# EAGLE board sd card copier (EAGLE 8.3.1)
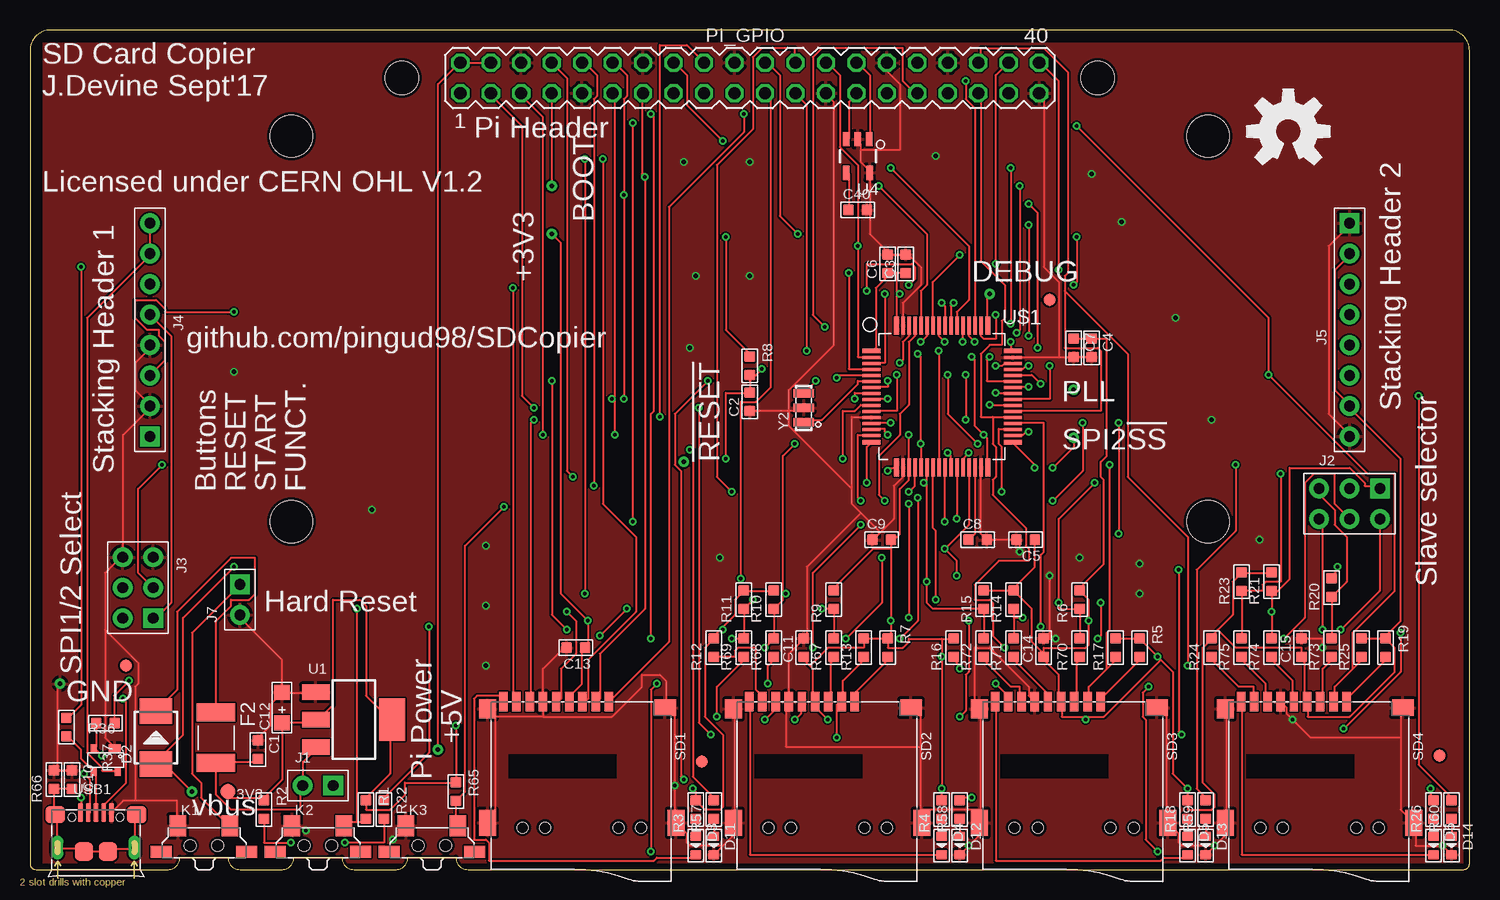
[diagram p2: board, top side]
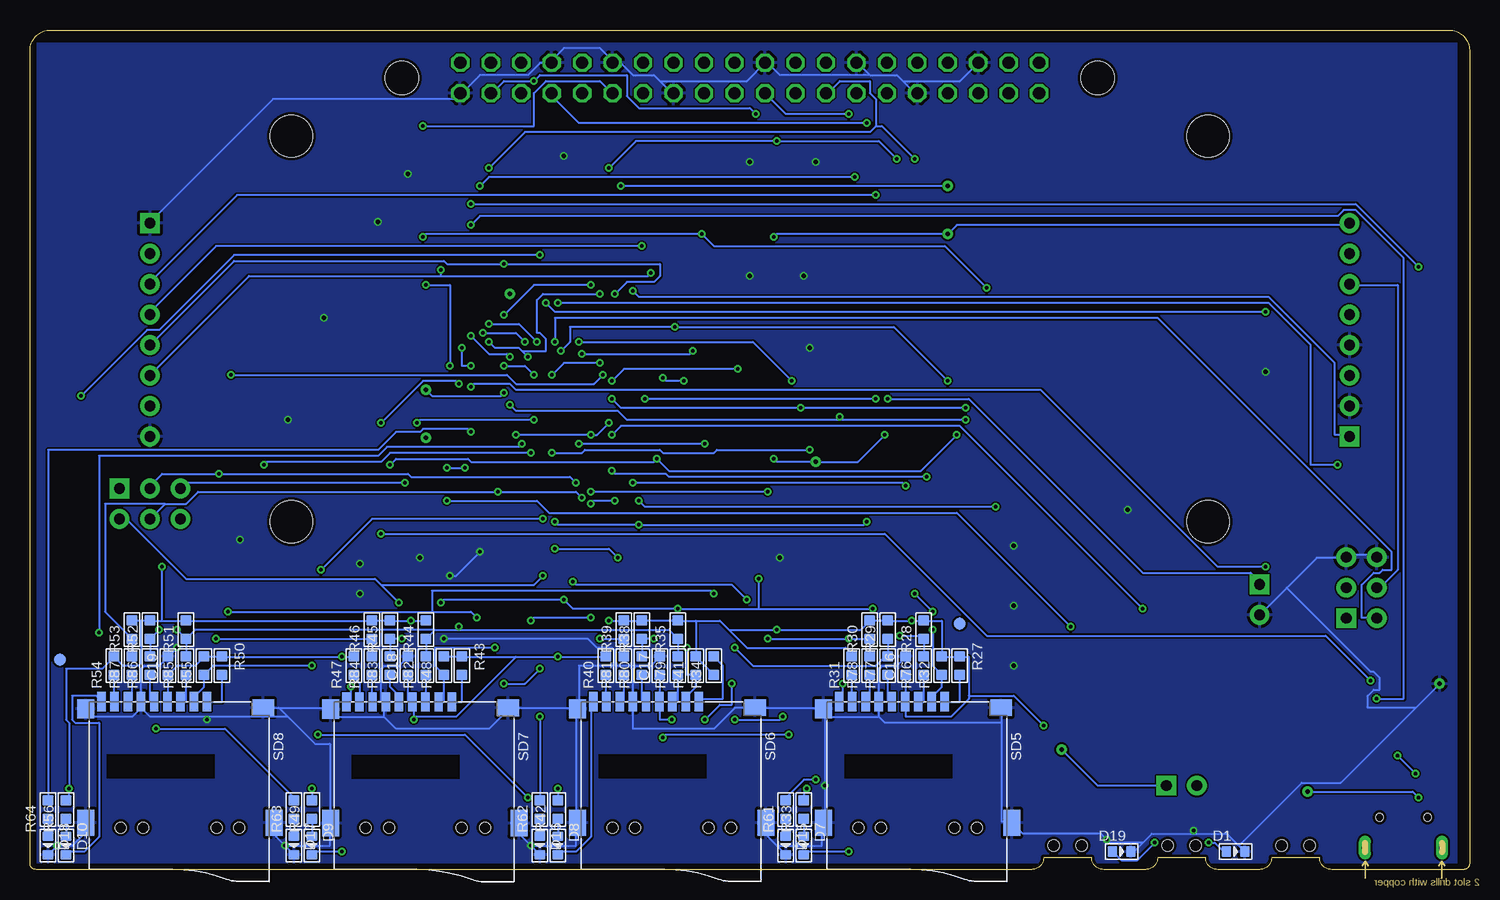
[diagram p3: board, bottom side, seen from below]

Size 120 x 70 mm. Coordinates in mm from the lower left corner, seen from the top.
Outline: 36.5,0 119.5,0 arc90 120,0.5 120,68.29 arc90 118.29,70 1.71,70 arc90 0,68.29 0,0.5 arc90 0.5,0 11.5,0 arc90 12.5,1 16.5,1 arc90 17.5,0 21,0 arc90 22,1 26,1 arc90 27,0 30.5,0 arc90 31.5,1 35.5,1 arc90 36.5,0
Copper layers (1*16): Top 0.035mm / dielectric 1.5mm / Bottom 0.035mm
Design rules "SeeedStudio_2layer_DRU_no_angle_20140221": minimum track width 6mil, minimum drill 12mil, track to track 6mil, track to pad 6mil, pad to pad 6mil, via to via 6mil, smd to smd 0mil, copper to edge 10mil, drill to drill 10mil, minimum pad ring 10mil, minimum via ring 6mil, stop-mask expansion 2mil, vias tented up to drill 100mil, thermal gap 10mil
Net classes: 2 thin_power: width 0.254 mm
Holes 3.51 mm at 21.8,29 98.2,29 21.8,61.15 98.2,61.15
Holes 2.75 mm at 31,66 89,66
tRestrict: area -1,-0.5 to 1,71; area 0,69 to 120,71; area 119.5,0 to 120.5,71; area 0,-0.5 to 120,0.5
bRestrict: area -1,-0.5 to 1,71; area 0,69 to 120,71; area 119.5,0 to 120.5,71; area 0,-0.5 to 120,0.5

## Footprints (pad centres in the part's own frame; a part is rotated, then mirrored left to right if it is on the bottom)
B1,27 = smd 1.27 x 1.27: TP 0,0
C0603 = smd 0.889 x 0.889: 1 0,0.762; 2 0,-0.762
AVX-A = smd 1.27 x 1.27: + -1.27,0; - 1.27,0
LED-0603 = smd 0.762 x 0.889: + -0.762,0; - 0.762,0
DO-214AA = smd 2.159 x 2.743: + -2.21,0; - 2.21,0
TP_15TH = drill 0.381 pad 0.61: P$1 0,0
SOT143B = smd 1 x 0.6: 1 -0.75,-1 | smd 0.5 x 0.6: 2 1,-1; 3 1,1; 4 -1,1
F1812 = smd 1.5 x 3.2: P$1 -2.1,0; P$2 2.1,0
FIDUCIAL-1X2 = smd 1 x 1: 1 0,0
H2-2.54 = drill 0.889 pad 1.651 square: 1 0,1.27 | drill 0.889 pad 1.651: 2 0,-1.27
H2X3-2.54 = drill 0.889 pad 1.651 square: 1 -1.27,2.54 | drill 0.889 pad 1.651: 2 -1.27,0; 3 -1.27,-2.54; 4 1.27,-2.54; 5 1.27,0; 6 1.27,2.54
H8-2.54 = drill 0.889 pad 1.651 square: 1 0,8.89 | drill 0.889 pad 1.651: 2 0,6.35; 3 0,3.81; 4 0,1.27; 5 0,-1.27; 6 0,-3.81; 7 0,-6.35; 8 0,-8.89
SW4-SMD-7.0X3.5X3.5MM-90D = smd 1.397 x 1.778: 1 -2.159,1.651; 2 2.159,1.651 | smd 1.778 x 1.016: S1 -3.556,-0.508; S2 3.556,-0.508 | hole 0.95: -1.15,0; 1.15,0
MA20-2 = drill 1.016 octagon: 1 -24.13,-1.27; 2 -24.13,1.27; 3 -21.59,-1.27; 4 -21.59,1.27; 5 -19.05,-1.27; 6 -19.05,1.27; 7 -16.51,-1.27; 8 -16.51,1.27; 9 -13.97,-1.27; 10 -13.97,1.27; 11 -11.43,-1.27; 12 -11.43,1.27; 13 -8.89,-1.27; 14 -8.89,1.27; 15 -6.35,-1.27; 16 -6.35,1.27; 17 -3.81,-1.27; 18 -3.81,1.27; 19 -1.27,-1.27; 20 -1.27,1.27; 21 1.27,-1.27; 22 1.27,1.27; 23 3.81,-1.27; 24 3.81,1.27; 25 6.35,-1.27; 26 6.35,1.27; 27 8.89,-1.27; 28 8.89,1.27; 29 11.43,-1.27; 30 11.43,1.27; 31 13.97,-1.27; 32 13.97,1.27; 33 16.51,-1.27; 34 16.51,1.27; 35 19.05,-1.27; 36 19.05,1.27; 37 21.59,-1.27; 38 21.59,1.27; 39 24.13,-1.27; 40 24.13,1.27
R0603 = smd 0.889 x 0.889: 1 0,0.762; 2 0,-0.762
MICRO-SD9+4P-SMD-16.1X14.5X1.85MM = smd 1.6 x 0.7: 1 0,2.25; 2 0,1.15; 3 0,0.05; 4 0,-1.05; 5 0,-2.15; 6 0,-3.25; 7 0,-4.35; 8 0,-5.45; 9 0,-6.55 | smd 1.6 x 1.4: G1 0.6,-7.85 | smd 2.2 x 1.4: G2 10.1,-7.85; G3 10.1,7.85 | smd 1.4 x 1.8: G4 0.5,6.95 | hole 0.9: 10.5,-4.95; 10.5,3.05
SOT-223 = smd 1.27 x 2.286: 1 -2.286,-3.175; 2 0,-3.175; 3 2.286,-3.175 | smd 3.556 x 2.159: TER 0,3.175
SOT235 = smd 0.55 x 1.2: 1 -0.95,-1.4; 2 0,-1.4; 3 0.95,-1.4; 4 0.95,1.4; 5 -1,1.4
LQFP64 = smd 1.5 x 0.4: P$1 -5.9,3.81; P$16 -5.9,-3.81; P$33 5.9,-3.81; P$48 5.9,3.81 | smd 1.5 x 0.28: P$2 -5.9,3.25; P$3 -5.9,2.75; P$4 -5.9,2.25; P$5 -5.9,1.75; P$6 -5.9,1.25; P$7 -5.9,0.75; P$8 -5.9,0.25; P$9 -5.9,-0.25; P$10 -5.9,-0.75; P$11 -5.9,-1.25; P$12 -5.9,-1.75; P$13 -5.9,-2.25; P$14 -5.9,-2.75; P$15 -5.9,-3.25; P$34 5.9,-3.25; P$35 5.9,-2.75; P$36 5.9,-2.25; P$37 5.9,-1.75; P$38 5.9,-1.25; P$39 5.9,-0.75; P$40 5.9,-0.25; P$41 5.9,0.25; P$42 5.9,0.75; P$43 5.9,1.25; P$44 5.9,1.75; P$45 5.9,2.25; P$46 5.9,2.75; P$47 5.9,3.25 | smd 0.4 x 1.5: P$17 -3.81,-5.9; P$32 3.81,-5.9; P$49 3.81,5.9; P$64 -3.81,5.9 | smd 0.28 x 1.5: P$18 -3.25,-5.9; P$19 -2.75,-5.9; P$20 -2.25,-5.9; P$21 -1.75,-5.9; P$22 -1.25,-5.9; P$23 -0.75,-5.9; P$24 -0.25,-5.9; P$25 0.25,-5.9; P$26 0.75,-5.9; P$27 1.25,-5.9; P$28 1.75,-5.9; P$29 2.25,-5.9; P$30 2.75,-5.9; P$31 3.25,-5.9; P$50 3.25,5.9; P$51 2.75,5.9; P$52 2.25,5.9; P$53 1.75,5.9; P$54 1.25,5.9; P$55 0.75,5.9; P$56 0.25,5.9; P$57 -0.25,5.9; P$58 -0.75,5.9; P$59 -1.25,5.9; P$60 -1.75,5.9; P$61 -2.25,5.9; P$62 -2.75,5.9; P$63 -3.25,5.9
MICRO-USB5+4P-SMD-0.65-B = smd 0.381 x 1.524: 1 -1.3,-0.25; 2 -0.65,-0.25; 3 0,-0.25; 4 0.65,-0.25; 5 1.3,-0.25 | smd 1.6 x 1.397: S1 -3.4,-0.427; S6 3.4,-0.427 | drill 0.508 pad 1.016 long: S2 -3.226,-3.175; S5 3.226,-3.175 | smd 1.5 x 1.5: S3 -1,-3.5; S4 1,-3.5 | hole 0.635: -2,-0.65; 2,-0.65
X3-SMD-3.6X1.3X0.8MM = smd 0.7 x 1.7: 1 -1.2,0; 2 0,0; 3 1.2,0

## Placement (x,y rotation side)
3V3  TPB1,27  [B1,27]  16.5,6.5 0 top
C1  10uf  [C0603]  19,10 0 top
C2  100nf  [C0603]  60,39 180 top
C3  100nf  [C0603]  73,50.5 180 top
C4  100nf  [C0603]  88.5,43.5 0 top
C5  100nf  [C0603]  83,27.5 270 top
C6  4.7uf  [C0603]  71.5,50.5 180 top
C7  4.7uf  [C0603]  87,43.5 0 top
C8  4.7uf  [C0603]  79,27.5 90 top
C9  4.7uf  [C0603]  71,27.5 90 top
C10  100nf  [C0603]  3.5,7.5 0 top
C11  100nf  [C0603]  64.5,18.5 180 top
C12  47uf  [AVX-A]  21,13.5 90 top
C13  100nf  [C0603]  45.5,18.5 270 top
C14  100nf  [C0603]  84.5,18.5 180 top
C15  100nf  [C0603]  106,18.5 180 top
C16  100nf  [C0603]  47,17 180 bottom
C17  100nf  [C0603]  67.5,17 180 bottom
C18  100nf  [C0603]  88.5,17 180 bottom
C19  100nf  [C0603]  108.5,17 180 bottom
C40  10uf  [C0603]  69,55 90 top
D1  GREEN-0603  [LED-0603]  19.5,1.5 0 bottom
D2  28V-5A  [DO-214AA]  10.5,11 90 top
D3  BLUE-0603  [LED-0603]  55.5,2 270 top
D4  BLUE-0603  [LED-0603]  76,2 270 top
D5  BLUE-0603  [LED-0603]  96.5,2 270 top
D6  BLUE-0603  [LED-0603]  117,2 270 top
D7  BLUE-0603  [LED-0603]  55.5,2 270 bottom
D8  BLUE-0603  [LED-0603]  76,2 270 bottom
D9  BLUE-0603  [LED-0603]  96.5,2 270 bottom
D10  BLUE-0603  [LED-0603]  117,2 270 bottom
D11  GREEN-0603  [LED-0603]  57,2 270 top
D12  GREEN-0603  [LED-0603]  77.5,2 270 top
D13  GREEN-0603  [LED-0603]  98,2 270 top
D14  GREEN-0603  [LED-0603]  118.5,2 270 top
D15  GREEN-0603  [LED-0603]  57,2 270 bottom
D16  GREEN-0603  [LED-0603]  77.5,2 270 bottom
D17  GREEN-0603  [LED-0603]  98,2 270 bottom
D18  GREEN-0603  [LED-0603]  118.5,2 270 bottom
D19  YELLOW-0603  [LED-0603]  29,1.5 0 bottom
DEBUG_TEST  TEST-POINTTP_15TH_THRU  [TP_15TH]  80,48 0 top
ESD1  PRTR5V0U2X  [SOT143B]  6.31,9.13 180 top
F2  307010004_SMD_PPCT_2000MA_1812  [F1812]  15.5,11 270 top
FD1  FIDUCIAL1X2  [FIDUCIAL-1X2]  8,17 0 top
FD2  FIDUCIAL1X2  [FIDUCIAL-1X2]  56,9 0 top
FD3  FIDUCIAL1X2  [FIDUCIAL-1X2]  117.5,9.5 0 top
FD4  FIDUCIAL1X2  [FIDUCIAL-1X2]  85,47.5 0 top
FD5  FIDUCIAL1X2  [FIDUCIAL-1X2]  42.5,20.5 0 bottom
FD6  FIDUCIAL1X2  [FIDUCIAL-1X2]  117.5,17.5 0 bottom
INT_CLK_TEST  TEST-POINTTP_15TH_THRU  [TP_15TH]  87,40 0 top
J1  [H2-2.54]  24,7 270 top
J2  2x3p-2.54  [H2X3-2.54]  110,30.5 270 top
J3  2x3p-2.54  [H2X3-2.54]  9,23.5 180 top
J4  8p-2.54  [H8-2.54]  10,45 180 top
J5  8p-2.54  [H8-2.54]  110,45 0 top
J7  [H2-2.54]  17.5,22.5 0 top
K1  TS-1188E  [SW4-SMD-7.0X3.5X3.5MM-90D]  14.5,2 0 top
K2  TS-1188E  [SW4-SMD-7.0X3.5X3.5MM-90D]  24,2 0 top
K3  TS-1188E  [SW4-SMD-7.0X3.5X3.5MM-90D]  33.5,2 0 top
OSHW  OSHW-LOGOL  [OSHW-LOGO-L]  104.89,61.55 0 top
PI_GPIO  [MA20-2]  60,66 0 top
R1  51K  [R0603]  28,5 180 top
R2  3K  [R0603]  19.5,5 180 top
R3  3K  [R0603]  55.5,5 0 top
R4  3K  [R0603]  76,5 0 top
R5  51K  [R0603]  92.5,18.5 180 top
R6  DNP  [R0603]  87.5,22.5 0 top
R7  51K  [R0603]  71.5,18.5 180 top
R8  51K  [R0603]  60,42 180 top
R9  51K  [R0603]  67,22.5 0 top
R10  51K  [R0603]  62,22.5 0 top
R11  51K  [R0603]  59.5,22.5 0 top
R12  51K  [R0603]  57,18.5 0 top
R13  51K  [R0603]  69.5,18.5 0 top
R14  DNP  [R0603]  82,22.5 0 top
R15  DNP  [R0603]  79.5,22.5 0 top
R16  51K  [R0603]  77,18.5 0 top
R17  51K  [R0603]  90.5,18.5 0 top
R18  3K  [R0603]  96.5,5 0 top
R19  51K  [R0603]  113,18.5 180 top
R20  DNP  [R0603]  108.5,23.5 0 top
R21  DNP  [R0603]  103.5,24 0 top
R22  3K  [R0603]  29.5,5 180 top
R23  DNP  [R0603]  101,24 0 top
R24  51K  [R0603]  98.5,18.5 0 top
R25  51K  [R0603]  111,18.5 0 top
R26  3K  [R0603]  117,5 0 top
R27  51K  [R0603]  42.5,17 180 bottom
R28  DNP  [R0603]  45.5,20 0 bottom
R29  DNP  [R0603]  48.5,20 0 bottom
R30  DNP  [R0603]  50,20 0 bottom
R31  51K  [R0603]  51.5,17 0 bottom
R32  51K  [R0603]  44,17 0 bottom
R33  3K  [R0603]  55.5,5 0 bottom
R34  51K  [R0603]  63,17 0 bottom
R35  51K  [R0603]  66,20 0 bottom
R36  22R  [R0603]  3.04,11.86 0 top
R37  22R  [R0603]  6.3,12.21 270 top
R38  51K  [R0603]  69,20 0 bottom
R39  51K  [R0603]  70.5,20 0 bottom
R40  51K  [R0603]  72,17 0 bottom
R41  51K  [R0603]  64.5,17 0 bottom
R42  3K  [R0603]  76,5 0 bottom
R43  51K  [R0603]  84,17 180 bottom
R44  DNP  [R0603]  87,20 0 bottom
R45  DNP  [R0603]  90,20 0 bottom
R46  DNP  [R0603]  91.5,20 0 bottom
R47  51K  [R0603]  93,17 0 bottom
R48  51K  [R0603]  85.5,17 0 bottom
R49  3K  [R0603]  96.5,5 0 bottom
R50  51K  [R0603]  104,17 180 bottom
R51  DNP  [R0603]  107,20 0 bottom
R52  DNP  [R0603]  110,20 0 bottom
R53  DNP  [R0603]  111.5,20 0 bottom
R54  51K  [R0603]  113,17 0 bottom
R55  51K  [R0603]  105.5,17 0 bottom
R56  3K  [R0603]  117,5 0 bottom
R57  3K  [R0603]  57,5 0 top
R58  3K  [R0603]  77.5,5 0 top
R59  3K  [R0603]  98,5 0 top
R60  3K  [R0603]  118.5,5 0 top
R61  3K  [R0603]  57,5 0 bottom
R62  3K  [R0603]  77.5,5 0 bottom
R63  3K  [R0603]  98,5 0 bottom
R64  3K  [R0603]  118.5,5 0 bottom
R65  51K  [R0603]  35.5,6.5 180 top
R66  1M  [R0603]  2,7.5 0 top
R67  39R 1/10W  [R0603]  67,18.5 0 top
R68  39R 1/10W  [R0603]  62,18.5 0 top
R69  39R 1/10W  [R0603]  59.5,18.5 0 top
R70  39R 1/10W  [R0603]  87.5,18.5 0 top
R71  39R 1/10W  [R0603]  82,18.5 0 top
R72  39R 1/10W  [R0603]  79.5,18.5 0 top
R73  39R 1/10W  [R0603]  108.5,18.5 0 top
R74  39R 1/10W  [R0603]  103.5,18.5 0 top
R75  39R 1/10W  [R0603]  101,18.5 0 top
R76  39R 1/10W  [R0603]  45.5,17 0 bottom
R77  39R 1/10W  [R0603]  48.5,17 0 bottom
R78  39R 1/10W  [R0603]  50,17 0 bottom
R79  39R 1/10W  [R0603]  66,17 0 bottom
R80  39R 1/10W  [R0603]  69,17 0 bottom
R81  39R 1/10W  [R0603]  70.5,17 0 bottom
R82  39R 1/10W  [R0603]  87,17 0 bottom
R83  39R 1/10W  [R0603]  90,17 0 bottom
R84  39R 1/10W  [R0603]  91.5,17 0 bottom
R85  39R 1/10W  [R0603]  107,17 0 bottom
R86  39R 1/10W  [R0603]  110,17 0 bottom
R87  39R 1/10W  [R0603]  111.5,17 0 bottom
SD1  ST-TF-003A  [MICRO-SD9+4P-SMD-16.1X14.5X1.85MM]  46,14 270 top
SD2  ST-TF-003A  [MICRO-SD9+4P-SMD-16.1X14.5X1.85MM]  66.5,14 270 top
SD3  ST-TF-003A  [MICRO-SD9+4P-SMD-16.1X14.5X1.85MM]  87,14 270 top
SD4  ST-TF-003A  [MICRO-SD9+4P-SMD-16.1X14.5X1.85MM]  107.5,14 270 top
SD5  ST-TF-003A  [MICRO-SD9+4P-SMD-16.1X14.5X1.85MM]  46,14 270 bottom
SD6  ST-TF-003A  [MICRO-SD9+4P-SMD-16.1X14.5X1.85MM]  66.5,14 270 bottom
SD7  ST-TF-003A  [MICRO-SD9+4P-SMD-16.1X14.5X1.85MM]  87.09,13.97 270 bottom
SD8  ST-TF-003A  [MICRO-SD9+4P-SMD-16.1X14.5X1.85MM]  107.5,14 270 bottom
TP1  TEST-POINTTP_15TH_THRU  [TP_15TH]  43.5,57 0 top
TP2  TEST-POINTTP_15TH_THRU  [TP_15TH]  54.5,34 0 top
TP3  TEST-POINTTP_15TH_THRU  [TP_15TH]  43.5,53 0 top
TP4  TEST-POINTTP_15TH_THRU  [TP_15TH]  2.5,15.5 0 top
TP5  TEST-POINTTP_15TH_THRU  [TP_15TH]  34,10 0 top
TP6  TEST-POINTTP_15TH_THRU  [TP_15TH]  13.5,6.5 0 top
TP7  TEST-POINTTP_15TH_THRU  [TP_15TH]  87,36 0 top
U1  CJT1117-3.3-SOT223  [SOT-223]  27,12.5 270 top
U4  310090051_24LC32AT-I/OT  [SOT235]  69,59.5 180 top
U$1  310010495_STM32F401RET6  [LQFP64]  76.03,39.44 0 top
USB1  ST-USB-001G  [MICRO-USB5+4P-SMD-0.65-B]  5.5,5 0 top
Y2  8MHZ  [X3-SMD-3.6X1.3X0.8MM]  64.5,38.5 90 top

## Tracks (layer width: path | path; a pad name or v marks a point on that pad's centre or on a via)
3V3
  Top 0.152: C40.1 68.25,58 U4.4
!RESET  (via drill 0.3)
  Top 0.152: K1.2 16.5,3.75 14.25,6 14.25,7.25 13.5,8 13.5,19.75 17.5,23.75 J7.1 | R8.1 60,40.75 | 60,40.75 C2.2 58,39.75 v58,34.25 | v71.5,40.75 71.5,40.25 70.25,40.25 U$1.P$7 | 60,40.75 v61,41.75 | v48.75,36.25 48.75,39.25 | 48.75,39.25 48.75,64.5 PI_GPIO.11 | 48.75,39.25 v48.5,39.25
  Bottom 0.152: v58,34.25 57.75,34 TP2.P$1 51,34 v48.75,36.25 | v71.5,40.75 70.5,41.75 v61,41.75 | v48.5,39.25 41.75,39.25 27.25,24.75 18.25,24.75 17.5,24 J7.1
+3V3  (via drill 0.3)
  Top 0.152: v58,52.75 58,45 60,43 R8.2 | ESD1.4 7.25,8.25 6,8.25 6,8.5 4.75,9.75 4.75,46 10,51.25 J4.7 J4.8 | 30,12.5 30,8 28,6 R1.2 28,5 30,5 31.25,6.25 31.25,7.25 R65.2 v35.5,12 | 19.5,6 16.5,6 3V3.TP | 19.5,6 21,7.5 C12.+ 21,12.25 23.75,12.25 23.75,12.5 U1.2 24,12.5 25.25,13.75 25.25,22.5 27.5,22.5 28,22 28,14.5 30,12.5 | 19.5,6 R2.2 | 30,12.5 U1.TER | v55.25,6.75 55.5,6.5 R33.1 56.25,5 57.5,5 57.75,5.25 57.75,11.25 56.25,12.75 56.25,18.5 R12.1 57,19.5 57.75,20.25 | 57.75,20.25 58.75,21.25 58.75,22.5 R11.1 | R11.1 R10.1 | R11.1 | SD1.4 45,14 45,14.5 46,15.5 46,18.25 C13.1 46.5,18.5 v46.5,20.75 44.25,23 44.25,52.25 TP3.P$1 | v57.75,20 57.75,20.25 | 65,17 65.25,16.75 65.25,14 SD2.4 65.5,14 65.5,13.5 v66.5,12.5 | 65,17 64.5,17.5 C11.1 | R42.1 v76,6.75 v76,17.75 76,19.25 | R7.2 R13.1 | 76,19.25 73.25,19.25 73.25,19 72.75,18.5 71.5,18.5 R7.2 | 76,19.25 R16.1 | R7.2 71.5,19.5 71.75,19.75 v71.75,20.75 71.75,26.75 | 65,17 66.5,18.5 69.5,18.5 R13.1 | R13.1 | 72.25,49.75 C3.1 | 72.25,49.75 C6.1 71.5,49.5 70.5,48.5 70.5,43.5 70.25,43.25 U$1.P$1 | 72.25,48 72.25,45.5 U$1.P$64 | 72.25,48 72.25,49.75 | 71.75,26.75 70.25,26.75 67,23.5 R9.1 | 71.75,26.75 C9.2 72,27.5 72.5,28 72.5,31.75 73.25,32.5 73.25,33.5 U$1.P$19 73.25,33.75 v73.25,36.25 | v71.75,37.25 70.25,37.25 U$1.P$13 | U$1.P$32 79.75,33.75 79.75,36 v79.5,36.25 78.75,37 78.75,42.5 v78.5,42.75 | v81.75,44 81.75,43.25 U$1.P$48 | v72.5,48 72.25,48 | J5.2 110,51.25 108.75,50 108.75,40 110,38.75 J5.7 110,38.5 114.25,34.25 114.25,20.75 113,19.5 R19.2 | 99,20 100.25,21.25 100.25,24 R23.1 | 99,20 98.5,19.5 R24.1 97.75,18.5 97.75,7.25 98.75,6.25 98.75,5.25 98.5,5 96.5,5 R49.1 v96.5,6.75 95.25,8 95.25,16.5 94.25,17.5
  Top 0.152: R23.1 R21.1 | R23.1 | R19.2 R25.1 | R19.2 113.75,18.5 113.75,16.5 110,12.75 106.5,12.75 106.5,14 SD4.4 106.25,14 106.25,17.25 106,17.5 C15.1 106,18.5 100.5,18.5 99,20 | v116.75,6.75 116.75,6.25 117,6 R56.1 | v109,25.25 109,25 108.5,24.5 R20.1 | R5.2 R17.1 | R5.2 v94,17.75 94.25,17.5 | R5.2 | R14.1 R15.1 | C5.1 83.75,25.25 82,23.5 R14.1 | C4.1 C7.1 | 84.5,18 84.5,18.5 88,18.5 88.25,18.75 v88.25,20.75 88.25,22.5 R6.1 87.5,23.5 89.5,25.5 89.5,32.5 89.25,32.75 89.25,34 89.75,34.5 89.75,44.25 C4.1 | C4.1 | R14.1 83.5,21.75 83.5,19 84.5,18 | 84.5,18 C14.1 84.5,17.5 85.75,16.25 85.75,14 SD3.4 86,14 86,12.75 88,12.75 | 94.25,17.5 89.5,12.75 88,12.75 | 88,12.75 v88,12.5
  Bottom 0.152: v58,52.75 57.75,53 TP3.P$1 42.75,53.75 10,53.75 J4.8 | R33.1 55.5,6.75 v55.25,6.75 | 47,14 C16.1 | R27.2 R32.1 44,20.75 R28.1 | R29.1 v46.5,20.75 R28.1 | R29.1 R30.1 | R29.1 | R28.1 | 47,14 47,12.75 43.25,12.75 41.75,14.25 41.75,14.5 | 41.75,14.5 41.75,17.75 R27.2 | 47,14 SD5.4 | R27.2 | R34.2 C11.1 R41.1 64.5,20.75 | R39.1 R38.1 | 61.75,20 62.5,20.75 64.5,20.75 | 61.75,20 60.25,18.5 52,18.5 51.5,18 R31.1 | R35.1 64.5,20.75 | R35.1 R38.1 | R38.1 | R35.1 | R30.1 50.75,20 v57.75,20 61.75,20 | R30.1 | v35.5,12 38,14.5 41.75,14.5 | C18.1 88.5,14 88.25,14 SD7.4 88,13.75 88,12.75 | R43.2 79.5,17.75 | 79.5,17.75 v76,17.75 R40.1 | R43.2 R48.1 | R43.2 | 88,12.75 84.5,12.75 79.5,17.75 | 67.5,14 C17.1 | 67.5,14 67.5,12.5 v66.5,12.5 | 67.5,14 SD6.4 | v76,6.75 R42.1 | v71.75,37.25 72.75,36.25 v73.25,36.25 v79.5,36.25 | v81.75,44 81.25,43.5 79.25,43.5 79,43.25 | v78.5,42.75 79,43.25 | v72.5,48 77.25,48 77.75,47.5 77.75,44.75 77.5,44.75 77,44.25 77,43.25 79,43.25 | R45.1 v88.25,20.75 R44.1 | R45.1 R46.1 | R45.1 | R56.1 117,6 116.75,6 v116.75,6.75 116.75,12.25 117,12.5 117,16.75 114,16.75 R54.1 | R52.1 109,20.75 | 109,20.75 R51.1 | R54.1 112.25,17 111,17 110.75,17.25 110.75,20.75 | R52.1 110.75,20.75 | R52.1 | 110.75,20.75 R53.1 | 109,20.75 v109,25.25 | R54.1 | R51.1 R46.1 | R46.1 | R51.1 | SD8.4 108.5,14 C19.1 107.75,17 106.25,17 R55.1 | R50.2 v94,17.75 R47.1 | R50.2 R55.1 | R50.2 | R55.1 | v96.5,6.75 R49.1 | v88,12.5 88,12.75 | v71.75,20.75 R39.1 | R39.1
+5V
  Top 0.152: PI_GPIO.4 38.25,67.25 36,67.25 PI_GPIO.2 35.75,67.25 34,65.5 TP5.P$1
  Bottom 0.152: TP5.P$1 31,7 J1.1
BOOT  (via drill 0.3)
  Top 0.152: v70.75,57 74.75,53 74.75,48.75 74.25,48.25 74.25,45.5 U$1.P$60 | TP1.P$1 43.5,64.5 PI_GPIO.7
  Bottom 0.152: TP1.P$1 v70.75,57
D+  (via drill 0.3)
  Top 0.152: v4.25,50.25 4.25,13.75 3.25,12.75 R36.1 | v83.25,55.5 84,54.75 v84,43.5 | v83.25,42 83,42 82.75,41.75 82,41.75 U$1.P$45
  Bottom 0.152: v4.25,50.25 9.5,55.5 v83.25,55.5 | v84,43.5 84,42 v83.25,42
D-  (via drill 0.3)
  Top 0.152: v8.25,15.75 7,14.5 7,12.25 R37.1 | v90.75,37.25 v90.75,28 | v84.25,40.5 83.5,41.25 82,41.25 U$1.P$44
  Bottom 0.152: v8.25,15.75 12,19.5 40.25,19.5 48.75,28 v90.75,28 | v90.75,37.25 87.25,40.75 84.5,40.75 v84.25,40.5
FUNCTION  (via drill 0.3)
  Top 0.152: K3.2 35.5,3.75 R65.1 36.25,6.5 36.25,27 v39.5,30.25 | v69.25,30.75 69,31 69,36.25 70,36.25 U$1.P$15
  Bottom 0.152: v69.25,30.75 68.75,30.25 v39.5,30.25
GND  (via drill 0.3, 0.35)
  Top 0.152: J5.8 110,36.25 108.25,38 108.25,52 110,53.75 J5.1 | 70,55 U4.5 70,58.25 69.25,59 69.25,60 | 69.25,60 69.25,60.5 69,60.75 U4.2 | 70,55 70,53 71.5,51.5 C6.2 C3.2 73,51.5 74.25,50.25 74.25,48.75 72.75,47.25 72.75,45.5 U$1.P$63 | 70,55 C40.2 | C7.2 C4.2 | 85.75,42.75 82,42.75 U$1.P$47 | 85.75,42.75 C7.2 | C7.2 | 85.75,42.75 85.75,49 84.5,50.25 84.5,64.25 84.25,64.5 PI_GPIO.39 | 69.25,60 72.5,60 72.5,65.5 71.5,66.5 71.5,67.25 PI_GPIO.30 | 74.25,5 74.25,4 SD6.G2 | 74.25,5 74.25,10.25 | 74.25,10.25 74.25,12.75 73.5,13.5 SD2.G4 | D16.- v78.25,2 79,2.75 79,3.75 SD3.G2 79.25,4 79.25,5 | 79.25,5 79.25,13.25 SD3.G1 79,13.5 78.75,13.75 78.75,18.5 80,18.5 83.25,15.25 83.25,14.5 SD3.6 | 79.25,5 74.25,5 | 63.25,38.25 64.5,38.25 Y2.2 | 63.25,38.25 C2.1 | 70.75,28 72,29.25 72,32 72.75,32.75 72.75,33.5 U$1.P$18 | 70.75,28 C9.1 | 68.5,31.75 68.5,30.5 69.25,29.75 | 68.5,31.75 68.5,37.75 70,37.75 U$1.P$12 | 69.25,29.75 70.75,28.25 70.75,28 | 63.25,38.25 63.25,37 68.5,31.75 | 69.25,29.75 64.75,25.25 64.75,19.75 64.5,19.5 C11.2 63.25,18 SD2.6 63,13.75 63,10.25 74.25,10.25 | D18.- v117.75,2 115.5,2 115.5,3.75 SD8.G2 114.25,5 114.25,11 | SD4.6 104.75,13.5 104.75,13 v105.25,12.5 106.75,11 114.25,11 | 114.25,11 114.25,13.5 SD4.G4 | SD3.G4 94,13.5 94.75,12.75 94.75,4 SD3.G3 95.75,3 95.75,2.25 96,2 v98.75,2 | v98.75,2 99.5,2.75 99.5,3.75 SD8.G3 99.75,4 99.75,13.25 SD4.G1 | v98.75,2 D17.- | v107.75,18.5 107.75,19.25 C15.2 | U$1.P$31 79.25,33.5 79.25,28 C8.2 C5.2 82.5,27.25 v82.5,26.5 | v85.5,19.25 85,19.25 | 85,19.25 C14.2 | 85,19.25 v85,24.5 | 21,14.75 20,13.75 20,12 19,11 C1.1 | 21,14.75 23.75,14.75 U1.1 | 21,14.75 C12.- 21,17.5 17.5,21 J7.2
  Top 0.152: J4.4 10,43.5 8.75,42.25 8.75,40 10,38.75 J4.2 10,38.5 7.75,36.25 7.75,26.25 J3.4 7.5,26 6.25,24.75 6.25,20 | 8.75,5.75 12.25,5.75 12.25,3.75 K1.1 | 8.75,5.75 7.75,5.75 6.75,4.75 USB1.5 | 6.25,20 6.25,11 7,10.25 ESD1.1 | 8.75,5.75 8.75,15.25 9,15.5 9,17.25 6.25,20 | 53,13.5 53.75,12.75 v53.75,7 53.75,4 SD5.G2 54.75,3 54.75,2.25 55,2 57.75,2 | 57.75,2 58.5,2.75 58.5,3.75 SD6.G3 58.75,4 58.75,13.25 SD2.G1 | 57.75,2 D15.- | C13.2 44.5,18.5 42.75,16.75 SD1.6 42.75,12.75 | 38.75,12.75 38.25,13.25 SD1.G1 38.75,12.75 | 42.75,12.75 38.75,12.75 | SD5.G3 38.75,4.5 38.75,12.75 | 53,13.5 53,15.75 52.5,16.25 51,16.25 51,15.25 48.5,12.75 42.75,12.75 | 53,13.5 SD1.G4 | C10.1 R66.1 2,8.5 2.25,8.75 2.25,15.25 TP4.P$1 | v23,3.25 23,3.5 22,3.5 K2.1 | v30.25,2.5 31.25,3.5 K3.1 | 63.25,38.25 63.25,40 67,43.75 67,64 66.5,64.5 PI_GPIO.25
  Bottom 0.152: 47.25,65.75 47.75,66.25 50,66.25 | 47.25,65.75 46.25,64.75 PI_GPIO.9 | 50,66.25 51,67.25 PI_GPIO.14 | 47.25,65.75 42.5,65.75 41,67.25 PI_GPIO.6 | 50,66.25 57.5,66.25 58.5,67.25 PI_GPIO.20 60.25,65.75 67.5,65.75 | 67.5,65.75 68,66.25 69.75,66.25 70.75,67.25 71.25,67.25 PI_GPIO.30 71.5,67.5 72.5,68.5 75.5,68.5 76.5,67.5 PI_GPIO.34 76.75,67.25 77.5,67.25 78.5,66.25 82.5,66.25 84,64.75 PI_GPIO.39 84.25,64.5 84.5,64.25 99.75,64.25 110,54 J5.1 | 67.5,65.75 66.5,64.75 PI_GPIO.25 | D18.- v117.75,2 116.5,2 115.5,3 115.5,3.75 SD8.G2 | v107.75,18.5 108.25,18 108.5,18 C19.2 109.25,17 110.5,17 110.75,16.75 SD8.6 110.75,13.5 | 110.75,13.5 111.5,12.75 114.75,12.75 115.25,13.25 SD8.G1 | v98.75,2 99.5,2.75 99.5,3.75 SD8.G3 | v98.75,2 D17.- | v98.75,2 95,2 95,3.75 SD7.G2 95,4 95,10.5 96.25,10.5 98.5,12.75 | C18.2 89.25,17 90.5,17 90.75,16.75 90.75,14 90.5,14 SD7.6 90.5,13.75 90.5,12.75 | SD8.G4 99.25,13.5 | 99.25,13.5 95,13.5 SD7.G1 94.75,13.25 94.25,12.75 90.5,12.75 | 99.25,13.5 98.5,12.75 | 110.75,13.5 110,12.75 105.25,12.75 | 98.5,12.75 105.25,12.75 | 105.25,12.75 v105.25,12.5 | v78.25,2 79,2.75 79,3.75 SD7.G3 | v78.25,2 D16.- | v78.25,2 74.5,2 74.5,3.75 SD6.G2 74.5,4 74.5,13.25 SD6.G1 | SD6.G1 74.5,13.5 80,13.5 SD7.G4 80.25,13.25 81.75,11.75 89.5,11.75 90.5,12.75 | 69.5,17 68.25,17 C17.2 | 69.5,17 69.75,16.75 SD6.6 69.75,11.75 63,11.75 61.25,13.5 SD6.G4 54,13.5 SD5.G1 | v85.5,19.25 73.5,19.25 72.75,18.5 71.5,18.5 71.25,18.25 71.25,17 | 69.5,17 71.25,17 | 71.25,17 74.25,17 74.25,13.5 SD6.G1 | v82.5,26.5 84.5,24.5 v85,24.5 | J3.4 7.75,26.25 10.25,26.25 J3.3 10.5,26 12.75,26 15.25,23.5
  Bottom 0.152: 15.25,23.5 17.5,21.25 J7.2 | 57.75,2 58.5,2.75 58.5,3.75 SD6.G3 | 57.75,2 D15.- | 57.75,2 54,2 54,3.75 SD5.G2 53.75,4 v53.75,7 53.75,12.75 53.25,12.75 | C16.2 47.75,17 49,17 49.25,16.75 SD5.6 49.25,12.75 | 53.25,12.75 49.25,12.75 | 53.25,12.75 53.75,13.25 SD5.G1 | 53.25,12.75 SD5.G1 | 39,12.25 39,4 38.25,4 SD5.G3 37.25,3 30.75,3 v30.25,2.5 30,2.25 27.25,2.25 | 39,12.25 39,13.5 SD5.G4 | 19.25,2 20.25,3 23,3 | 19.25,2 D1.- | 23,3 26.5,3 27.25,2.25 | 27.25,2.25 28,1.5 D19.- | 23,3 v23,3.25 | 4.5,13.5 10.75,7.25 14,7.25 19.25,2 | 4.5,13.5 TP4.P$1 | 49.25,12.75 48.75,12.25 39,12.25 | 15.25,23.5 8.25,16.5 8,16.5 7.5,16 7.5,15 8,15 8.5,14.5 8.5,13.5 4.5,13.5
  other vias: 38,17 38,22 38,27 28.5,30 17,41.5 88.5,58 91,54 95.5,46 98.5,37.5 92.5,25.5 87.5,26 92.5,23 102.5,27.5 54.5,59 60,59 60,49.5 55.5,49.5 55,43.5 75.5,59.5 57.5,26
  pour Bottom: -1.5,71.5 121.5,71.5 121.5,-1 -1.5,-1
  pour Top: -1,71.5 121.5,71.5 121.5,-1 -1.5,-1 -1.5,71.5
ID  (via drill 0.3)
  Top 0.152: v80,42.75 79.75,42.5 79.75,40.75 81.75,40.75 U$1.P$43 | v83.25,53.75 v83.25,44.5 | v7.75,14.25 8,14 8,7.25 6.25,5.5 6.25,4.75 USB1.4
  Bottom 0.152: v80,42.75 80.25,43 81.75,43 v83.25,44.5 | v83.25,53.75 82.5,54.5 11,54.5 10.5,55 9.5,55 5.5,51 5.5,14.25 v7.75,14.25
ID_SC
  Top 0.152: U4.1 70,61 70,66.25 69,67.25 PI_GPIO.28
ID_SD
  Top 0.152: U4.3 68.25,61 68.25,64 68.75,64.5 PI_GPIO.27
N$1  (via drill 0.3)
  Top 0.152: v21.75,2.25 19.5,2.25 R2.1
  Bottom 0.152: v21.75,2.25 21.25,2.25 20.5,1.5 D1.+
N$2
  Top 0.152: F2.P$1 15.5,20.75 16.75,22 16.75,22.5 18.25,22.5 18.75,23 18.75,26 16.75,26 12.25,21.5 12.25,15 10.5,13.25 D2.-
N$3
  Top 0.152: C8.1 78.75,28 78.75,33.5 U$1.P$30
N$4
  Top 0.152: USB1.S6 8.75,4.5 8.75,2 USB1.S5 8.5,1.75 6.5,1.75 USB1.S4 USB1.S3 4.5,1.75 2.5,1.75 USB1.S2 2.25,2 2.25,4.5 USB1.S1 2,4.75 R66.2 C10.2
N$5
  Top 0.152: USB1.3 5.5,8 ESD1.3 5.25,8.25 4.25,9.25 4.25,10 3.25,11 R36.2
N$6  (via drill 0.3)
  Top 0.152: R37.2 5.5,12 5.5,10.25 ESD1.2 5.5,10 v6,9.5 | v4.5,8 5,7.5 5,4.75 USB1.2
  Bottom 0.152: v4.5,8 v6,9.5
N$7  (via drill 0.3)
  Top 0.152: v67.25,41 67.25,41.25 70,41.25 U$1.P$5 | v65.5,40.75 64.5,39.75 Y2.3
  Bottom 0.152: v67.25,41 67,40.75 v65.5,40.75
N$9
  Top 0.152: C1.2 19,9 15.5,9 F2.P$2 15.5,6.25 16.75,5 22.5,5 22.5,7 J1.2 22.75,7 22.75,9 23.75,10 U1.3
N$10
  Top 0.152: R4.2 D4.+
N$11
  Top 0.152: R3.2 D3.+
N$12  (via drill 0.3)
  Top 0.152: v77.5,16.75 77.5,17 77,17.5 R16.2 | v80.5,15.5 81.5,14.5 81.5,14 SD3.8
  Bottom 0.152: v77.5,16.75 78.75,15.5 v80.5,15.5
N$13
  Top 0.152: SD3.1 89.25,14.25 92.5,17.5 R5.1
N$15
  Top 0.152: R18.2 D5.+
N$17
  Top 0.152: R24.2 98.5,17.5 100.75,15.25 102,15.25 102,14 SD4.8
N$19
  Top 0.152: U$1.P$6 70,40.75 69,40.75 69,40.5 66,37.5 64.5,37.5 Y2.1
N$20
  Top 0.152: R12.2 58.75,17.75 58.75,18.25 59,18.5 60.5,18.5 60.5,15 61,14.5 61,14 SD2.8
N$21
  Top 0.152: SD4.1 109.75,14.25 113,17.5 R19.1
N$22
  Top 0.152: SD2.1 68.75,14.75 71.5,17.5 R7.1
N$23
  Top 0.152: R26.2 D6.+
N$24
  Bottom 0.152: R31.2 51.5,14 SD5.8
N$25
  Bottom 0.152: R27.1 42.5,14 SD5.1
N$26
  Bottom 0.152: R33.2 D7.+
N$27
  Bottom 0.152: R43.1 84,14 84.75,14 SD7.1
N$28
  Bottom 0.152: SD6.1 64,14.25 62.25,14.25 62.25,17 R34.1
N$29
  Bottom 0.152: R42.2 D8.+
N$30
  Bottom 0.152: R49.2 D9.+
N$31
  Bottom 0.152: R47.2 93,16 92.5,15.5 92.5,14 SD7.8
N$32
  Bottom 0.152: R50.1 104,14 SD8.1
N$33
  Bottom 0.152: R40.2 72,14 SD6.8
N$34
  Bottom 0.152: R56.2 D10.+
N$35
  Bottom 0.152: R54.2 113,14 SD8.8
N$36
  Top 0.152: R57.2 D11.+
N$38
  Top 0.152: R58.2 D12.+
N$40
  Top 0.152: R59.2 D13.+
N$42
  Top 0.152: R60.2 D14.+
N$44
  Bottom 0.152: R61.2 D15.+
N$46
  Bottom 0.152: R62.2 D16.+
N$48
  Bottom 0.152: R63.2 D17.+
N$50
  Bottom 0.152: R64.2 D18.+
N$56  (via drill 0.3)
  Top 0.152: v26.25,2.25 29.5,2.25 R22.1
  Bottom 0.152: v26.25,2.25 27.75,0.75 29,0.75 D19.+
N$57
  Top 0.152: R67.2 67,17.5 66.75,17.25 66.75,14 SD2.3
N$58  (via drill 0.3)
  Top 0.152: v61.5,15.5 61.5,17 62,17.5 R68.2 | v63.75,12.5 64.25,13 64.25,14 SD2.5
  Bottom 0.152: v61.5,15.5 61.5,13.75 62.5,13.75 v63.75,12.5
N$59  (via drill 0.3)
  Top 0.152: v57.25,12.75 57.25,15.25 59.5,17.5 R69.2 | v61.25,12.5 62,13.25 62,14 SD2.7
  Bottom 0.152: v57.25,12.75 57.5,12.5 v61.25,12.5
N$60
  Top 0.152: R70.2 87.5,17.5 87.25,17.25 87.25,14 SD3.3
N$61
  Top 0.152: R71.2 82,17.5 84.75,14.75 84.75,14 SD3.5
N$62
  Top 0.152: R72.2 79.5,17.5 81.75,15.25 82.5,15.25 82.5,14 SD3.7
N$63
  Top 0.152: R73.2 108.5,17.5 107.75,16.75 107.75,14 SD4.3
N$64
  Top 0.152: R74.2 103.5,17.5 105.25,15.75 105.25,14 SD4.5
N$65
  Top 0.152: R75.2 101,17.5 103,15.5 103,14 SD4.7
N$66
  Bottom 0.152: R76.2 45.5,14 SD5.3
N$67
  Bottom 0.152: R77.2 48.5,14 SD5.5
N$68
  Bottom 0.152: R78.2 50,14 SD5.7
N$69
  Bottom 0.152: R79.2 66,14 SD6.3
N$70
  Bottom 0.152: R80.2 69,14 SD6.5
N$71
  Bottom 0.152: R81.2 70.5,14 SD6.7
N$72
  Bottom 0.152: R82.2 87,14 SD7.3
N$73
  Bottom 0.152: R83.2 90,15.25 89.25,14.5 89.25,14 SD7.5
N$74
  Bottom 0.152: R84.2 91.5,14 SD7.7
N$75
  Bottom 0.152: R85.2 107,14 SD8.3
N$76
  Bottom 0.152: R86.2 110,14 SD8.5
N$77
  Bottom 0.152: R87.2 111.5,14 SD8.7
N$99  (via drill 0.3)
  Top 0.152: v80.5,39.75 81.75,39.75 U$1.P$41
  Bottom 0.152: v80.5,39.75 80.75,39.5 86.5,39.5 INT_CLK_TEST.P$1
N$100
  Top 0.152: DEBUG_TEST.P$1 79.75,47.75 79.75,45.5 U$1.P$49
RX  (via drill 0.3)
  Top 0.152: v71.5,33.25 71.5,33.5 72.25,33.5 U$1.P$17 | v45.25,32.75 44.75,33.25 44.75,66 43.5,67.25 PI_GPIO.8
  Bottom 0.152: v71.5,33.25 71.25,33 67,33 66.75,32.75 v45.25,32.75
SD1CDN
  Top 0.152: D3.- 55.5,1 52.25,1 52,0.75 38.25,0.75 38.25,2.25 38,2.5 37,2.5 37,14.25 37.25,14.5 39.25,14.5 39.25,14 SD1.9
SD1LED  (via drill 0.3)
  Top 0.152: v55,35 55.25,34.75 55.25,7.75 57,6 R57.1 | v76.5,34.75 76.75,34.5 76.75,33.75 U$1.P$26
  Bottom 0.152: v55,35 62.75,35 63,34.75 67.25,34.75 67.5,35 73.75,35 74,34.75 v76.5,34.75
SD2!SS  (via drill 0.3)
  Top 0.152: R13.2 69.5,17.5 67.75,15.75 67.75,14 SD2.2 67.5,14 67.25,13.75 v67.25,11 | v71.5,39.25 70.25,39.25 U$1.P$9 | v42,38.5 41,39.5 41,62 38.5,64.5 PI_GPIO.3 | v56.75,11.25 55.75,12.25 v55.75,38.5
  Bottom 0.152: v71.5,39.25 70.75,38.5 v55.75,38.5 v42,38.5 | v67.25,11 67,11.25 v56.75,11.25
SD2CDN
  Top 0.152: D4.- 60,1.25 60,14 SD2.9
SD2LED  (via drill 0.3)
  Top 0.152: v78.5,6 77.5,6 R58.1 | v96,11.25 95.75,11.5 v95.75,25 | v77.25,29.25 77.25,33.5 U$1.P$27
  Bottom 0.152: v78.5,6 83.75,11.25 v96,11.25 | v95.75,25 91.5,29.25 v77.25,29.25
SD3!SS  (via drill 0.3)
  Top 0.152: 89.75,16.75 88.25,15.25 88.25,14 SD3.2 | 89.75,16.75 90.5,17.5 R17.2 | v67.75,34.25 67.75,38.25 68.75,38.25 69.25,38.75 70,38.75 U$1.P$10 | v90,33.75 90,20 89.75,19.75 89.75,16.75 | v42.75,36.25 42.75,62.75 41,64.5 PI_GPIO.5
  Bottom 0.152: v90,33.75 89.5,34.25 83.5,34.25 83.25,34 68,34 v67.75,34.25 66.75,33.25 45.75,33.25 v42.75,36.25
SD3CDN
  Top 0.152: D5.- 96.5,1 94.5,1 94.25,0.75 80.5,0.75 80.5,14 SD3.9
SD3LED  (via drill 0.3)
  Top 0.152: v100.5,33.75 100.5,28.25 97.25,25 97.25,6.75 98,6 R59.1 | v78.25,34.75 77.75,34.25 77.75,33.75 U$1.P$28
  Bottom 0.152: v100.5,33.75 100.25,34 90.75,34 90,34.75 v78.25,34.75
SD4!SS  (via drill 0.3)
  Top 0.152: 110.25,16.75 108.75,15.25 108.75,14 SD4.2 | 110.25,16.75 111,17.5 R25.2 | v72.25,41.25 72.25,38.25 70.25,38.25 U$1.P$11 | 110.25,16.75 110.25,19.75 113.75,23.25 113.75,33 111.5,33 v103.25,41.25 103.25,46 v87.25,62
  Bottom 0.152: v72.25,41.25 73,40.5 79.5,40.5 80.25,41.25 v103.25,41.25 | v87.25,62 78,62 78,64.75 77,65.75 72.5,65.75 71.5,64.75 PI_GPIO.29
SD4CDN
  Top 0.152: D6.- 101,1.25 101,14 SD4.9
SD4LED  (via drill 0.3)
  Top 0.152: v115.75,39.5 115.75,8.75 118.5,6 R60.1 | v77.5,51.25 75.25,49 75.25,45.5 U$1.P$58
  Bottom 0.152: v115.75,39.5 110.25,45 109.25,45 103,51.25 v77.5,51.25
SD5!SS  (via drill 0.3)
  Top 0.152: v75.75,43.25 75.75,33.75 U$1.P$24 | v66.25,45.25 65.25,46.25 65.25,67.75 66,68.5 72.75,68.5 72.75,65.75 73.75,64.75 PI_GPIO.31 | v44.75,20 43.5,21.25 v43.5,40.75
  Bottom 0.152: SD5.2 44.75,14 44.75,14.5 44,15.25 R32.2 44.75,17 v44.75,20 | v75.75,43.25 75,44 75,45.25 v66.25,45.25 48,45.25 v43.5,40.75
SD5CDN  (via drill 0.3)
  Top 0.152: v51.75,1.5 51.75,15 v52.25,15.5
  Bottom 0.152: v51.75,1.5 55.25,1.5 D7.- | v52.25,15.5 52.25,14 SD5.9
SD5LED  (via drill 0.3)
  Top 0.152: v54.5,7.5 54.25,7.75 54.25,33.25 53.75,33.75 53.75,38 v56.5,40.75 | v74.25,44 74.75,44.5 74.75,45.25 U$1.P$59
  Bottom 0.152: v54.5,7.5 55.5,7.5 57,6 R61.1 | v56.5,40.75 59.75,44 v74.25,44
SD6!SS  (via drill 0.3)
  Top 0.152: v76.25,29 76.25,33.5 U$1.P$25 | v69.25,28.75 65.25,24.75 v65.25,18.5 | v50.25,29 v50.25,62.25
  Bottom 0.152: SD6.2 65.25,14 65.25,14.5 64.5,15.25 R41.2 65.25,16.25 v65.25,18.5 | v76.25,29 76,28.75 v69.25,28.75 50.5,28.75 v50.25,29 | v50.25,62.25 74.25,62.25 76.5,64.5 PI_GPIO.33
SD6CDN
  Bottom 0.152: D8.- 75.75,1.5 74.5,1.5 73.25,2.75 73.25,14 SD6.9
SD6LED  (via drill 0.3)
  Top 0.152: v77.5,12.75 78,13.25 78,16.25 78.25,16.5 v78.25,20.75 | v73.25,30.5 v73.25,21 | v71.25,30.75 70.75,31.25 70.75,34.5 72.5,36.25 72.5,38 73.25,38.75 73.25,44 73.75,44.5 73.75,45.25 U$1.P$61
  Bottom 0.152: v77.5,12.75 R62.1 | v78.25,20.75 78,21 v73.25,21 | v73.25,30.5 73,30.75 v71.25,30.75
SD7!SS  (via drill 0.3)
  Top 0.152: 80.25,37.75 79.25,37.75 79.25,43 80,43.75 81,43.75 81,45.75 81.25,46 81.25,48.75 79.25,50.75 79.25,64.5 PI_GPIO.35 | 80.25,37.75 81.75,37.75 U$1.P$37 | v81.25,18.5 80.25,19.5 80.25,22.25 80,22.5 78.75,22.5 78.75,23.75 80.75,25.75 83.25,25.75 83.25,26.75 83,27 83,28.5 80.25,31.25 80.25,32.5 80.5,32.75 80.5,35.25 80.25,35.5 80.25,37.75
  Bottom 0.152: SD7.2 85.75,14 85.5,14 R48.2 86.25,17 86.25,18.5 v81.25,18.5
SD7CDN  (via drill 0.3)
  Top 0.152: v94,1.5 93,2.5 93,12.5 92.75,12.75 92.75,14.75 v93.25,15.25
  Bottom 0.152: v94,1.5 96.25,1.5 D9.- | v93.25,15.25 93.25,14 93.5,14 SD7.9
SD7LED  (via drill 0.3)
  Top 0.152: v109.5,11.75 114.25,16.5 v114.25,19.75 | v79,35.5 76.5,38 v76.5,41.25 | v72.5,42.25 72.75,42.5 72.75,44 73.25,44.5 73.25,45.25 U$1.P$62
  Bottom 0.152: v109.5,11.75 103.75,11.75 98,6 R63.1 | v114.25,19.75 114.25,34.5 91,34.5 90.25,35.25 79.25,35.25 v79,35.5 | v76.5,41.25 75.5,42.25 v72.5,42.25
SD8!SS  (via drill 0.3)
  Top 0.152: 86.25,48.25 86.25,49.5 86.5,49.75 86.5,66.5 84.5,68.5 79.25,68.5 79.25,67.5 PI_GPIO.36 | 86.25,48.25 86.25,43.5 89,43.5 89.25,43.25 89.25,38.25 82,38.25 U$1.P$38 | v96.5,17 96.5,27.75 91.5,32.75 91.5,43 86.25,48.25
  Bottom 0.152: SD8.2 106.25,14 106.25,14.5 105.5,15.25 R55.2 104.75,17 v96.5,17
SD8CDN
  Bottom 0.152: D10.- 116.75,1.5 115.5,1.5 114.25,2.75 114.25,12.25 116.25,12.25 116.5,12.5 116.5,14.5 114.5,14.5 114,14 SD8.9
SD8LED  (via drill 0.3)
  Top 0.152: v83.25,36.5 83,36.5 82.75,36.25 82,36.25 U$1.P$34
  Bottom 0.152: R64.1 118.5,35 91,35 89.5,36.5 87.5,36.5 87.25,36.75 83.5,36.75 v83.25,36.5
SDIO0  (via drill 0.3)
  Top 0.152: v80,38.75 81.75,38.75 U$1.P$39 | v42,37.5 41.75,37.25 41.75,14 SD1.7 | v52.5,37.75 52.5,68.75 54.75,68.75 56,67.5 PI_GPIO.18
  Bottom 0.152: v80,38.75 79.5,38.25 71,38.25 70.25,37.5 52.5,37.5 | v42,37.5 52.5,37.5 | 52.5,37.5 v52.5,37.75
SDIO1  (via drill 0.3)
  Top 0.152: v85,42 85,39.25 82,39.25 U$1.P$40 | v87,48.75 87.25,49 v87.25,52.75 | v64,53 62.5,54.5 62.5,66.25 61.5,67.25 PI_GPIO.22 | v40.25,48.5 40.25,14.25 40.5,14 SD1.8
  Bottom 0.152: v85,42 85,48.75 v87,48.75 | v87.25,52.75 87,53 v64,53 63,52 43.75,52 v40.25,48.5
SDIO2  (via drill 0.3)
  Top 0.152: v78,65.75 78,64.25 78.75,63.5 78.75,45.5 U$1.P$51 | SD1.1 53.25,19 53.25,55.25 59.5,61.5 v59.5,63
  Bottom 0.152: PI_GPIO.37 81.5,64.75 80.5,65.75 v78,65.75 77.5,66.25 70.25,66.25 70.25,64.5 69.25,63.5 60,63.5 v59.5,63
SDIO3  (via drill 0.3)
  Top 0.152: v78.75,44 78.25,44.5 78.25,45.25 U$1.P$52 | v82.25,44.75 82.5,45 v82.5,57 | PI_GPIO.13 51,64.5 51,58 v51.25,57.75 51.25,21.75 47.5,18 47.5,14.25 47.25,14 SD1.2
  Bottom 0.152: v78.75,44 79.5,44.75 v82.25,44.75 | v82.5,57 81.75,57.75 v51.25,57.75
SDIOCLK  (via drill 0.3)
  Top 0.152: v77.75,44 77.75,45.25 U$1.P$53 | v81.75,58.5 v81.75,45.5 | v44.75,21.5 45.5,20.75 45.5,18 44.25,16.75 44.25,14.25 44,14 SD1.5 | v46.25,59.25 v46.25,23
  Bottom 0.152: v77.75,44 79.25,45.5 v81.75,45.5 | v81.75,58.5 78.75,61.5 50,61.5 49.5,62 | 49.5,62 49.5,64.25 50,64.75 50,65.75 52.5,65.75 53.5,64.75 PI_GPIO.15 | v46.25,23 v44.75,21.5 | v46.25,59.25 49,62 49.5,62
SDIOCMD  (via drill 0.3)
  Top 0.152: v71.75,58.5 78.25,52 78.25,47.5 77.25,46.5 77.25,45.5 U$1.P$54 | v57.75,60.75 54.75,63.75 54.75,66.25 53.75,67.25 PI_GPIO.16 | v47.75,59.25 47.75,30.5 50.5,27.75 50.5,21.5 46.5,17.5 46.5,14.25 46.25,14 SD1.3
  Bottom 0.152: v71.75,58.5 69.5,60.75 v57.75,60.75 49.25,60.75 v47.75,59.25
SPI1_!SS  (via drill 0.3)
  Top 0.152: v73.25,31.5 73.75,32 73.75,33.5 U$1.P$20 | v58.5,31.5 57.25,32.75 57.25,58.75 60.25,61.75 60.25,67.75 61,68.5 63.75,68.5 63.75,67.5 PI_GPIO.24
  Bottom 0.152: v58.5,31.5 v73.25,31.5
SPI1_CLK  (via drill 0.3)
  Top 0.152: R14.2 82,21 | 82,21 R71.1 | R21.2 103.5,22.75 | 103.5,22.75 v103.5,21.5 R74.1 | v82.75,21 82,21 | 103.5,22.75 105,24.25 105,33.5 110,33.5 111.25,32.25 111.25,32 112.5,32 J2.1 | v61.25,18.5 R68.1 R10.2 62.75,22.5 62.75,23 | v63.75,35.5 62.75,34.5 62.75,23 | U$1.P$21 74.25,33.75 v74.25,35.5 74.25,42.75 v74,43 | v64.75,43.25 64.75,63.75 64,64.5 PI_GPIO.23 | 62.75,23 v63,23
  Bottom 0.152: v82.75,21 83.25,21.5 86.5,21.5 | v103.5,21.5 86.5,21.5 | R29.2 R77.1 48.75,17.5 49,17.5 49.5,17 59.75,17 v61.25,18.5 | v63.75,35.5 v74.25,35.5 | v64.75,43.25 65,43 v74,43 | 86.5,21.5 86.5,23.25 63.25,23.25 v63,23
SPI1_MISO  (via drill 0.3)
  Top 0.152: R72.1 R15.2 75.25,21.75 74.75,22.25 v74.75,24 74.75,32.25 | 74.75,32.25 74.75,33.5 U$1.P$22 | R75.1 R23.2 102.75,23.25 102.75,23.75 103,24 104.25,24 v104.25,33 | v74.5,32.25 74.75,32.25 | v58.5,19.25 R69.1 R11.2 v60.25,22.5 | v51.75,63 52,62.75 52,38.25 51.75,38 v51.75,19.25
  Bottom 0.152: J2.2 110,32 109,33 v104.25,33 88.5,33 88.25,32.75 75,32.75 v74.5,32.25 | R78.1 R30.2 v51.75,19.25 v58.5,19.25 | PI_GPIO.19 57,63 v51.75,63 | v74.75,24 74.5,23.75 61.5,23.75 v60.25,22.5
SPI1_MOSI  (via drill 0.3)
  Top 0.152: R73.1 R20.2 109.75,24 109.75,27.75 108.75,28.75 108.75,30 107.5,31.25 107.5,31.75 J2.3 | R70.1 R6.2 85.75,21.75 v85.75,22.25 85.75,29.25 v88.75,32.25 | R67.1 R9.2 v66,21.75 | v49.75,21.75 v47.5,19.5 | v75.5,22.5 75.5,28.25 75.25,28.5 75.25,33.5 U$1.P$23 | PI_GPIO.21 61.75,64.25 61.75,40.25 60.5,39 59.25,39 v59.25,24.25
  Bottom 0.152: R76.1 R28.2 45.75,19.5 v47.5,19.5 | 59.25,21.75 v66,21.75 74.75,21.75 v75.5,22.5 85.5,22.5 v85.75,22.25 | 59.25,21.75 v49.75,21.75 | 59.25,21.75 v59.25,24.25 | v88.75,32.25 107,32.25 107.25,32 J2.3
SPI2_!SS  (via drill 0.3)
  Top 0.152: v83.75,33.5 83.75,33.75 82,35.5 U$1.P$33 | v85.25,33.5 87,35.25 TP7.P$1
  Bottom 0.152: v85.25,33.5 v83.75,33.5
SPI2_CLK  (via drill 0.3)
  Top 0.152: v68,19.25 71,22.25 v71,26 | U$1.P$29 78.25,33.5 78.25,28.75 v76.25,26.75 77.25,25.75 v77.25,24.5 | v89,19.25 89.25,19.5 v89.25,22.25 | v109.25,20 112.5,23.25 112.5,29 J2.6
  Bottom 0.152: R80.1 R38.2 v68,19.25 | v71,26 71.75,26.75 v76.25,26.75 | R86.1 R52.2 v109.25,20 | R83.1 R45.2 v89,19.25 | 90.75,23.75 91.25,24.25 107,24.25 111.75,29 112.5,29 J2.6 | 90.75,23.75 v89.25,22.25 | v77.25,24.5 78,23.75 90.75,23.75
SPI2_MISO  (via drill 0.3)
  Top 0.152: v72.5,19.25 74,20.75 v74,31 | v104.5,19.25 106.25,21 106.25,32.25 107,33 108.75,33 108.75,30.5 110,29.25 J2.5 | v81,31.5 81,35.25 80.75,35.5 80.75,36.75 81.75,36.75 U$1.P$35
  Bottom 0.152: R87.1 R53.2 113.75,21.5 113.75,30.5 108.75,30.5 | R84.1 R46.2 v104.5,19.25 | R81.1 R39.2 v72.5,19.25 | v74,31 74.5,31.5 v81,31.5 106,31.5 107,30.5 108.75,30.5 | 108.75,30.5 110,29.25 J2.5
SPI2_MOSI  (via drill 0.3)
  Top 0.152: v84.25,20.25 84.25,26.25 84.5,26.5 84.5,37.25 82,37.25 U$1.P$36 | v107.75,20 107.75,28.75 107.5,29 J2.4
  Bottom 0.152: R85.1 R51.2 | R79.1 R35.2 66.75,20 84.25,20 | R82.1 R44.2 86.25,20 | 86.25,20 84.25,20 | R51.2 106.25,20 86.25,20 | 84.25,20 v84.25,20.25 | R51.2 v107.75,20
SPI3_!SS  (via drill 0.3)
  Top 0.152: v80.5,46.25 80.5,44.25 79.5,44.25 79.25,44.5 79.25,45.25 U$1.P$50 | v73.25,48.75 73.75,49.25 73.75,50.25 73.5,50.5 69.75,50.5 v69.75,48.25
  Bottom 0.152: v80.5,46.25 78,48.75 v73.25,48.75 | v69.75,48.25 69.25,47.75 16.75,47.75 11.25,42.25 11.25,36.25 10,36.25 J4.1
SPI3_CLK  (via drill 0.3)
  Top 0.152: v77,47.25 76.75,47 76.75,45.5 U$1.P$55 | v17,46.5 11.25,46.5 11.25,46.75 10.5,47.5 8.75,47.5 8.75,46 9.75,45 10.75,45 10.75,44.5 11.25,44 11.25,42.5 10,41.25 J4.3
  Bottom 0.152: v77,47.25 76.25,46.5 v17,46.5
SPI3_MISO  (via drill 0.3)
  Top 0.152: v76,47.25 76.25,47 76.25,45.5 U$1.P$56 | v11,33.75 9,31.75 9,24.75 10.25,23.5 J3.2
  Bottom 0.152: v76,47.25 16.75,47.25 13.25,43.75 13.25,33.75 v11,33.75
SPI3_MISOPIN
  Top 0.152: J3.1 10.5,21 11.75,22.25 11.75,44.5 10,46.25 J4.5
SPI3_MOSI  (via drill 0.3)
  Top 0.152: v76.25,44 75.75,44.5 75.75,45.25 U$1.P$57
  Bottom 0.152: v76.25,44 76.25,46 26,46 6.5,26.5 6.5,25 7.25,25 7.5,24.75 8,24.75 9,23.75 9,21 7.75,21 J3.6
SPI3_MOSIPIN
  Bottom 0.152: J3.5 7.5,23.5 6,25 6,48.75 10,48.75 J4.6
STACK1  (via drill 0.3)
  Top 0.152: v68.75,39.25 68.75,39.75 70,39.75 U$1.P$8 | v49.5,39.25 v49.5,56.25 49.5,64.25 49.75,64.5 49.75,66.25 48.75,67.25 PI_GPIO.12
  Bottom 0.152: v49.5,39.25 v68.75,39.25 | v49.5,56.25 102.75,56.25 110,49 J5.3
STACK2  (via drill 0.3)
  Top 0.152: U$1.P$2 70,42.75 69,42.75 v69,52 69,58.75 67.5,60.25 67.5,66.25 66.5,67.25 PI_GPIO.26
  Bottom 0.152: v69,52 104.5,52 110,46.5 J5.4
STACK3  (via drill 0.3)
  Top 0.152: v71.25,48 71.25,42.25 70.25,42.25 U$1.P$3 | v80.5,50.5 80.5,66.25 81.5,67.25 PI_GPIO.38
  Bottom 0.152: v71.25,48 70.25,49 68,49 67.5,49.5 67.5,50.5 v80.5,50.5 85.25,50.5 85.5,50.75 103,50.75 110,43.75 J5.5
STACK4  (via drill 0.3)
  Top 0.152: v68.25,49.75 68.25,41.75 70,41.75 U$1.P$4 | v85.75,50 85.75,65.75 84.25,67.25 PI_GPIO.40
  Bottom 0.152: v68.25,49.75 68.5,49.5 85.75,49.5 | 85.75,49.5 101.75,49.5 110,41.25 J5.6 | 85.75,49.5 v85.75,50
START_COPY  (via drill 0.3)
  Top 0.152: 27.25,4 26.25,4 26.25,3.75 K2.2 | 27.25,4 28,4 R1.1 | v71.5,36.25 71.25,36.5 71.25,36.75 70.25,36.75 U$1.P$14 | 27.25,4 v27.25,21.75
  Bottom 0.152: v71.5,36.25 70.75,37 42.5,37 v27.25,21.75
STATUSLED  (via drill 0.3)
  Top 0.152: v33.25,20.25 33.25,9.75 29.5,6 R22.2 | v85.25,30.75 87.75,33.25 v87.75,37.25 | v78,41.25 v78,37.5 | v80.5,42 81,42 81.25,42.25 81.75,42.25 U$1.P$46
  Bottom 0.152: v33.25,20.25 42.75,29.75 76.75,29.75 77.75,30.75 v85.25,30.75 | v87.75,37.25 87.5,37.5 v78,37.5 | v78,41.25 78.75,42 v80.5,42
TX  (via drill 0.3)
  Top 0.152: v69.75,32.25 69.75,35.25 70,35.5 U$1.P$16 | v47,32 47,64.25 47.25,64.5 47.25,66.25 46.25,67.25 PI_GPIO.10
  Bottom 0.152: v69.75,32.25 47.25,32.25 v47,32
VBUS  (via drill 0.3)
  Top 0.152: v4.25,6 4.25,4.75 USB1.1 | v83.25,40.25 82,40.25 U$1.P$42 | v17,25.25 12.75,21 12.75,11.25 10.75,9.25 | 10.75,9.25 10.5,9 D2.+ 10.75,9.25 | 10.75,9.25 TP6.P$1
  Bottom 0.152: v4.25,6 4.75,6.5 TP6.P$1 | v83.25,40.25 83,40.5 80,40.5 79.5,40 35.75,40 21,25.25 v17,25.25

## Text on the board
tSilk: Buttons | RESET | START | FUNCT.
_tsilk: Pi Header | Stacking Header 2 | SD Card Copier / J.Devine Sept'17 / / / Licensed under CERN OHL V1.2 | BOOT | +3V3 | DEBUG | github.com/pingud98/SDCopier | Slave selector | PLL | SPI2!SS | !RESET | Stacking Header 1 | SPI1/2 Select | Hard Reset | GND | +5V | Pi Power | vbus